# EAGLE design JEMA (EAGLE 9.6.2)

## Sheet 1 of 3
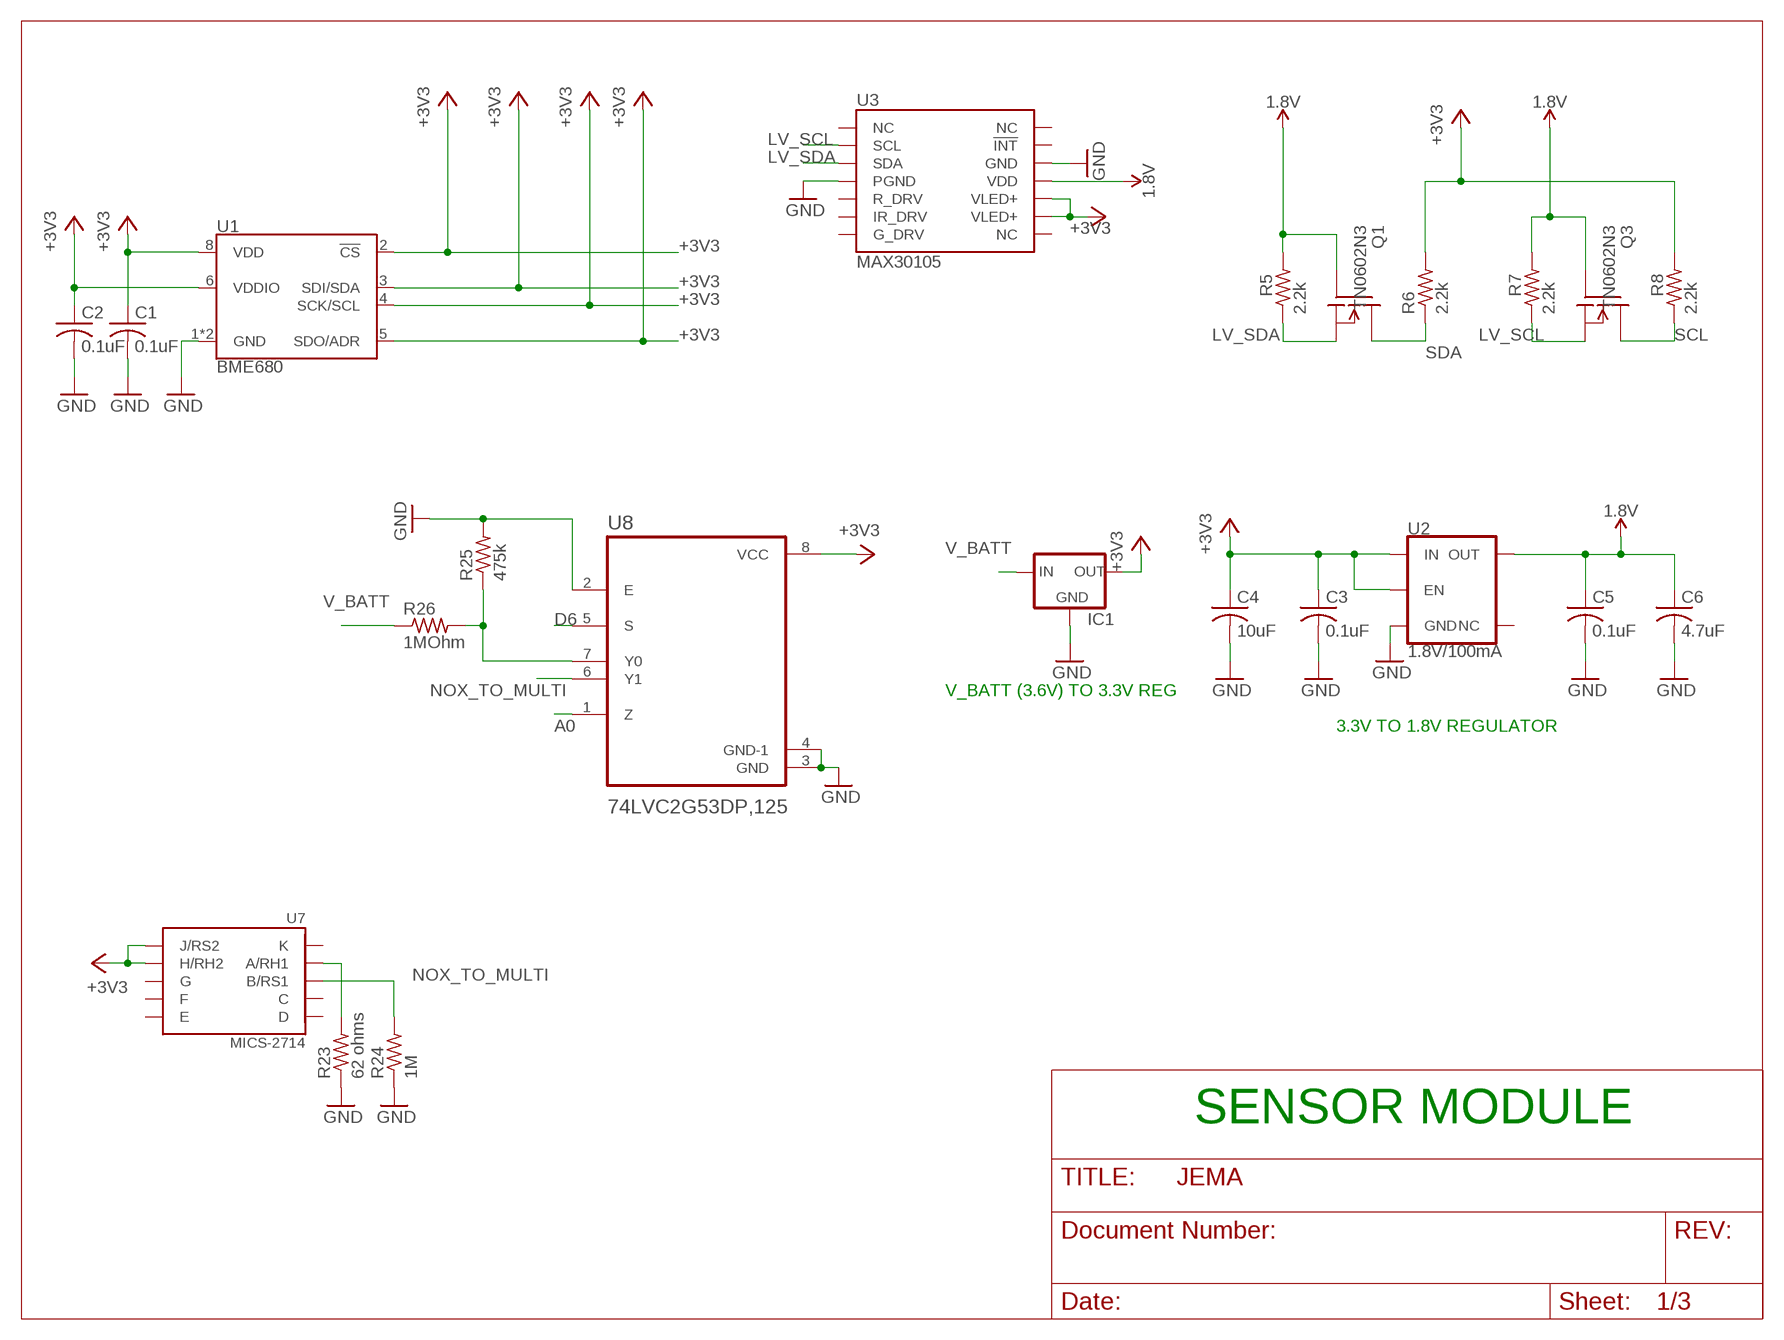
[diagram p0: schematic, sheet 1]

### Parts
C1  0.1uF  C-USC0805  [C0805]
C2  0.1uF  C-USC0805  [C0805]
C3  0.1uF  C-USC0805  [C0805]
C4  10uF  C-USC0805  [C0805]
C5  0.1uF  C-USC0805  [C0805]
C6  4.7uF  C-USC0805  [C0805]
IC1  MCP1700TRI  [TO92]
Q1  TN0602N3  [TO-92]
Q3  TN0602N3  [TO-92]
R5  2.2k  R-US_R0805  [R0805]
R6  2.2k  R-US_R0805  [R0805]
R7  2.2k  R-US_R0805  [R0805]
R8  2.2k  R-US_R0805  [R0805]
R23  62 ohms  R-US_M0805  [M0805]
R24  1M  R-US_M0805  [M0805]
R25  475k  R-US_M0805  [M0805]
R26  1MOhm  R-US_M0805  [M0805]
U1  BME680  BME680-LGA  [LGA3.0X3.0]
U2  1.8V/100mA  V_REG_SP6214-1.8V  [SC70]
U3  MAX30105  MAX3010X-30105  [OLGA-14]
U7  MICS-2714  [MICS-SMD10]
U8  74LVC2G53DP,125  [SOP65P490X110-8N]

### Nets
1.8V: C5.1 C6.1 Q1.2(G) Q3.2(G) R5.2 R7.2 U2.5(OUT) U3.11(VDD)
+3V3: C1.1 C2.1 C3.1 C4.1 IC1.3(OUT) R6.2 R8.2 U1.2(!CS) U1.3(SDI/SDA) U1.4(SCK/SCL) U1.5(SDO/ADR) U1.6(VDDIO) U1.8(VDD) U2.1(IN) U2.3(EN) U3.9(VLED+) U3.10(VLED+) U7.H(H/RH2) U7.J(J/RS2) U8.8(VCC) ; also sheet 2,3
A0: U8.1(Z) ; also sheet 2
D6: U8.5(S) ; also sheet 2
GND: C1.2 C2.2 C3.2 C4.2 C5.2 C6.2 IC1.1(GND) R23.1 R24.1 R25.2 U1.1(GND) U1.7(GND) U2.2(GND) U3.4(PGND) U3.12(GND) U8.2(E) U8.3(GND) U8.4(GND-1) ; also sheet 2,3
LV_SCL: Q3.1(S) R7.1 U3.2(SCL)
LV_SDA: Q1.1(S) R5.1 U3.3(SDA)
N$21: R25.1 R26.2 U8.7(Y0)
N$23: R23.2 U7.A(A/RH1)
NOX_TO_MULTI: R24.2 U7.B(B/RS1) U8.6(Y1)
SCL: Q3.3(D) R8.1 ; also sheet 2
SDA: Q1.3(D) R6.1 ; also sheet 2
V_BATT: IC1.2(IN) R26.1 ; also sheet 2,3
Unconnected: U2.4(NC) U3.1(NC) U3.5(R_DRV) U3.6(IR_DRV) U3.7(G_DRV) U3.8(NC) U3.13(!INT) U3.14(NC) U7.C U7.D U7.E U7.F U7.G U7.K

### Notes on the sheet
- V_BATT (3.6V) TO 3.3V REG
- 3.3V TO 1.8V REGULATOR
- SENSOR MODULE

## Sheet 2 of 3
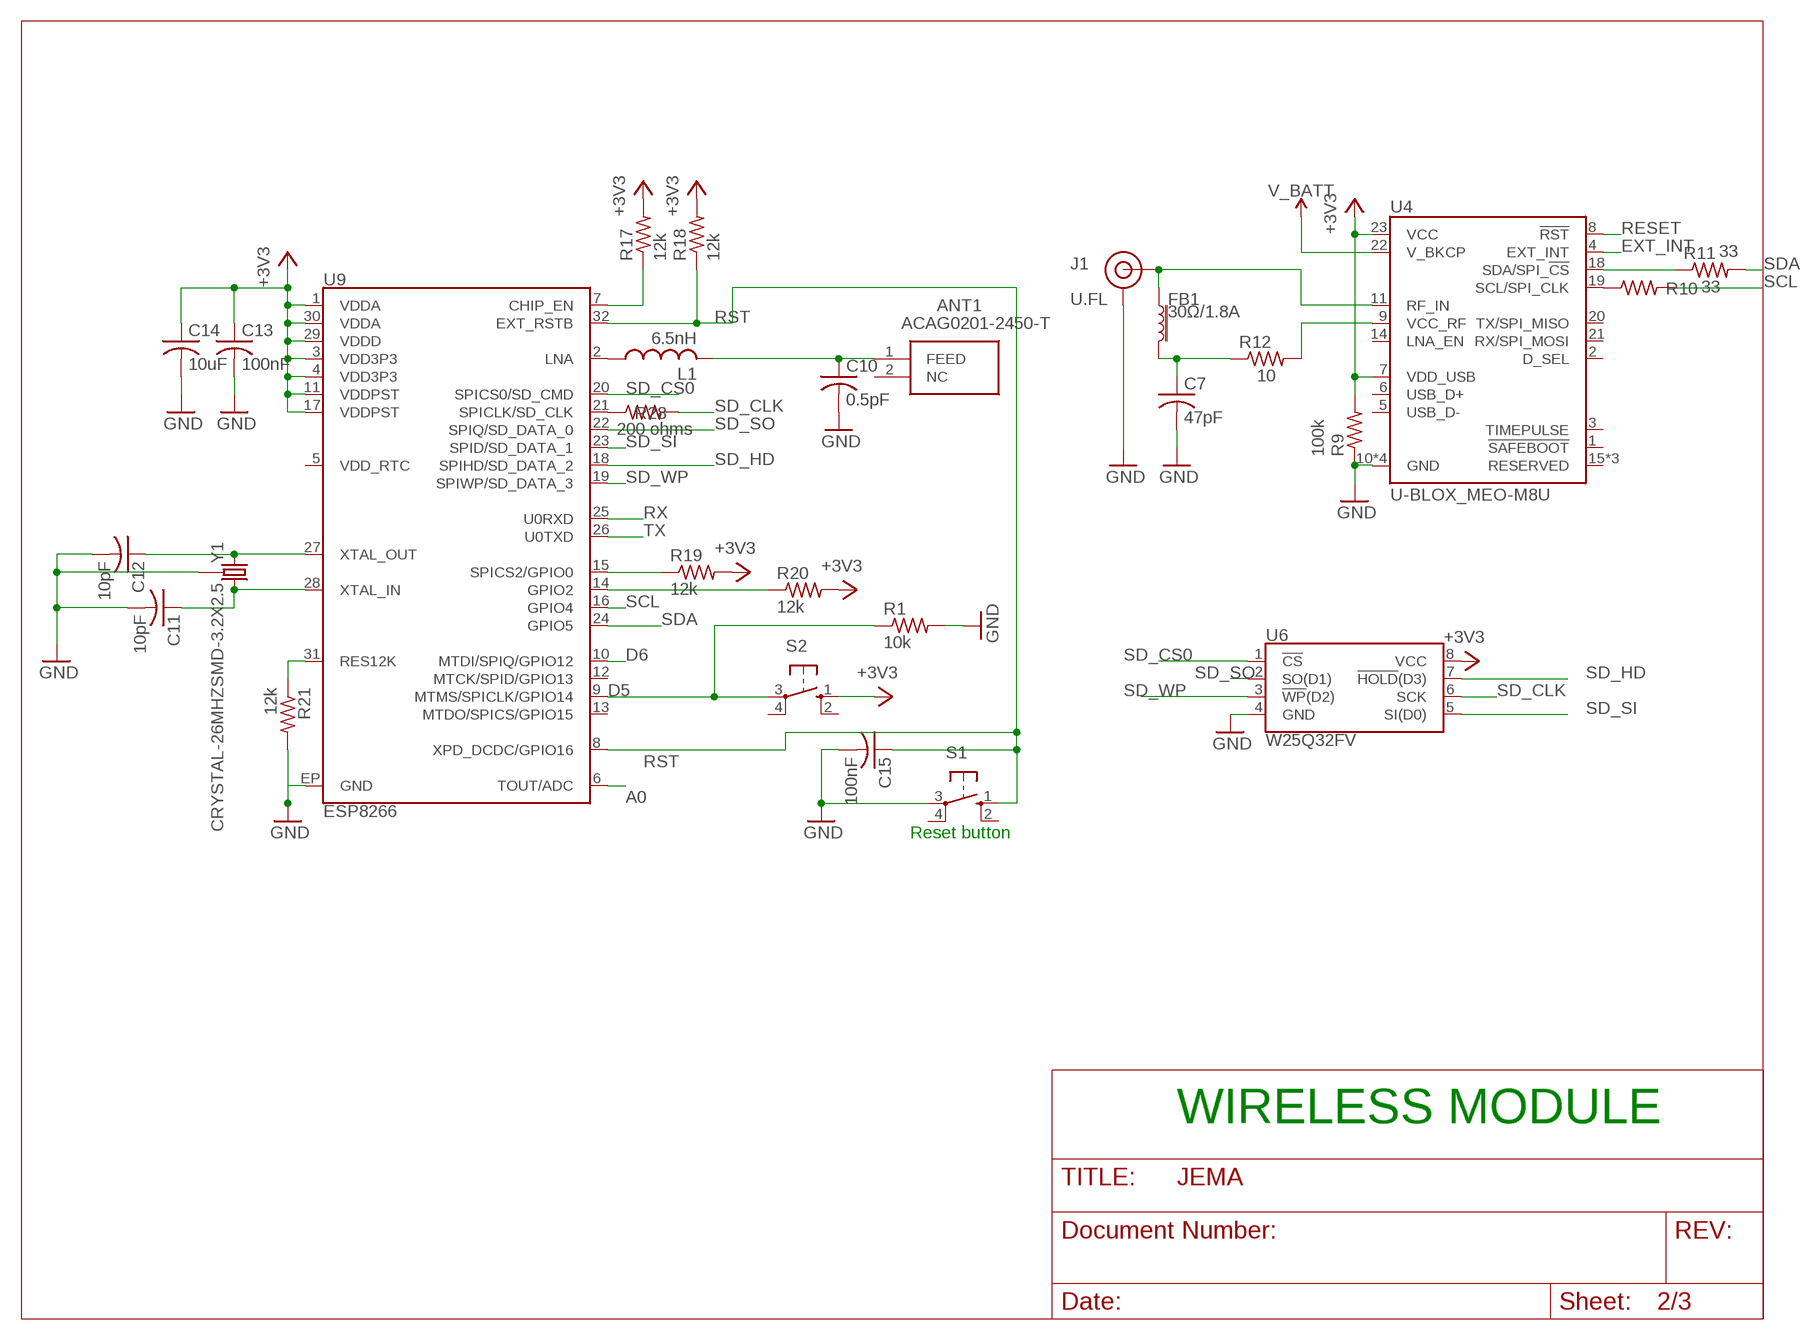
[diagram p1: schematic, sheet 2]

### Parts
ANT1  ACAG0201-2450-T  [ANTC2012X70N]
C7  47pF  C-USC0805  [C0805]
C10  0.5pF  C-USC0805  [C0805]
C11  10pF  C-USC0805  [C0805]
C12  10pF  C-USC0805  [C0805]
C13  100nF  C-USC0805  [C0805]
C14  10uF  C-USC0805  [C0805]
C15  100nF  C-USC0805  [C0805]
FB1  30Ω/1.8A  FERRITE_BEAD-0603  [0603]
J1  U.FL  U.FL2PIN  [U.FL]
L1  6.5nH  L-USL3225M  [L3225M]
R1  10k  R-US_R0805  [R0805]
R9  100k  R-US_R0805  [R0805]
R10  33  R-US_R0805  [R0805]
R11  33  R-US_R0805  [R0805]
R12  10  R-US_R0805  [R0805]
R17  12k  R-US_M0805  [M0805]
R18  12k  R-US_M0805  [M0805]
R19  12k  R-US_M0805  [M0805]
R20  12k  R-US_M0805  [M0805]
R21  12k  R-US_M0805  [M0805]
R28  200 ohms  R-US_R0805  [R0805]
S1  10-XX  [B3F-10XX]
S2  10-XX  [B3F-10XX]
U4  U-BLOX_MEO-M8U  [NEO-M9N/M8T/M8U]
U6  W25Q32FV  W25Q32FVSS  [SOIC-8]
U9  ESP8266  [QFN32-5X5MM]
Y1  CRYSTAL-26MHZSMD-3.2X2.5  [CRYSTAL-SMD-3.2X2.5MM]

### Nets
+3V3: C13.1 C14.1 R9.2 R17.2 R18.2 R19.2 R20.2 S2.1(S) U4.7(VDD_USB) U4.23(VCC) U6.8(VCC) U9.1(VDDA) U9.3(VDD3P3) U9.4(VDD3P3) U9.11(VDDPST) U9.17(VDDPST) U9.29(VDDD) U9.30(VDDA) ; also sheet 1,3
A0: U9.6(TOUT/ADC) ; also sheet 1
D5: R1.1 S2.3(P) U9.9(MTMS/SPICLK/GPIO14)
D6: U9.10(MTDI/SPIQ/GPIO12) ; also sheet 1
EXT_INT: U4.4(EXT_INT)
GND: C7.2 C10.2 C11.2 C12.2 C13.2 C14.2 C15.2 J1.1(GND) J1.2(GND) R1.2 R9.1 R21.2 S1.3(P) U4.10(GND) U4.12(GND) U4.13(GND) U4.24(GND) U6.4(GND) U9.EP(GND) Y1.2(GND) Y1.4(GND) ; also sheet 1,3
N$1: R10.1 U4.19(SCL/SPI_CLK)
N$2: R11.1 U4.18(SDA/SPI_!CS!)
N$5: C7.1 FB1.2 R12.1
N$7: R12.2 U4.9(VCC_RF)
N$9: R17.1 U9.7(CHIP_EN)
N$10: L1.1 U9.2(LNA)
N$11: ANT1.1(FEED) C10.1 L1.2
N$12: R19.1 U9.15(SPICS2/GPIO0)
N$13: R20.1 U9.14(GPIO2)
N$14: R21.1 U9.31(RES12K)
N$15: C12.1 U9.27(XTAL_OUT) Y1.1
N$16: C11.1 U9.28(XTAL_IN) Y1.3
N$17: FB1.1 J1.FEED(SIGNAL) U4.11(RF_IN)
N$25: R28.1 U9.21(SPICLK/SD_CLK)
RESET: U4.8(!RST)
RST: C15.1 R18.1 S1.1(S) U9.8(XPD_DCDC/GPIO16) U9.32(EXT_RSTB)
RX: U9.25(U0RXD)
SCL: R10.2 U9.16(GPIO4) ; also sheet 1
SD_CLK: R28.2 U6.6(SCK)
SD_CS0: U6.1(!CS!) U9.20(SPICS0/SD_CMD)
SD_HD: U6.7(!HOLD!(D3)) U9.18(SPIHD/SD_DATA_2)
SD_SI: U6.5(SI(D0)) U9.23(SPID/SD_DATA_1)
SD_SO: U6.2(SO(D1)) U9.22(SPIQ/SD_DATA_0)
SD_WP: U6.3(!WP!(D2)) U9.19(SPIWP/SD_DATA_3)
SDA: R11.2 U9.24(GPIO5) ; also sheet 1
TX: U9.26(U0TXD)
V_BATT: U4.22(V_BKCP) ; also sheet 1,3
Unconnected: ANT1.2(NC) S1.2(S1) S1.4(P1) S2.2(S1) S2.4(P1) U4.1(!SAFEBOOT!) U4.2(D_SEL) U4.3(TIMEPULSE) U4.5(USB_D-) U4.6(USB_D+) U4.14(LNA_EN) U4.15(RESERVED) U4.16(RESERVED) U4.17(RESERVED) U4.20(TX/SPI_MISO) U4.21(RX/SPI_MOSI) U9.5(VDD_RTC) U9.12(MTCK/SPID/GPIO13) U9.13(MTDO/SPICS/GPIO15)

### Notes on the sheet
- Reset button
- WIRELESS MODULE

## Sheet 3 of 3
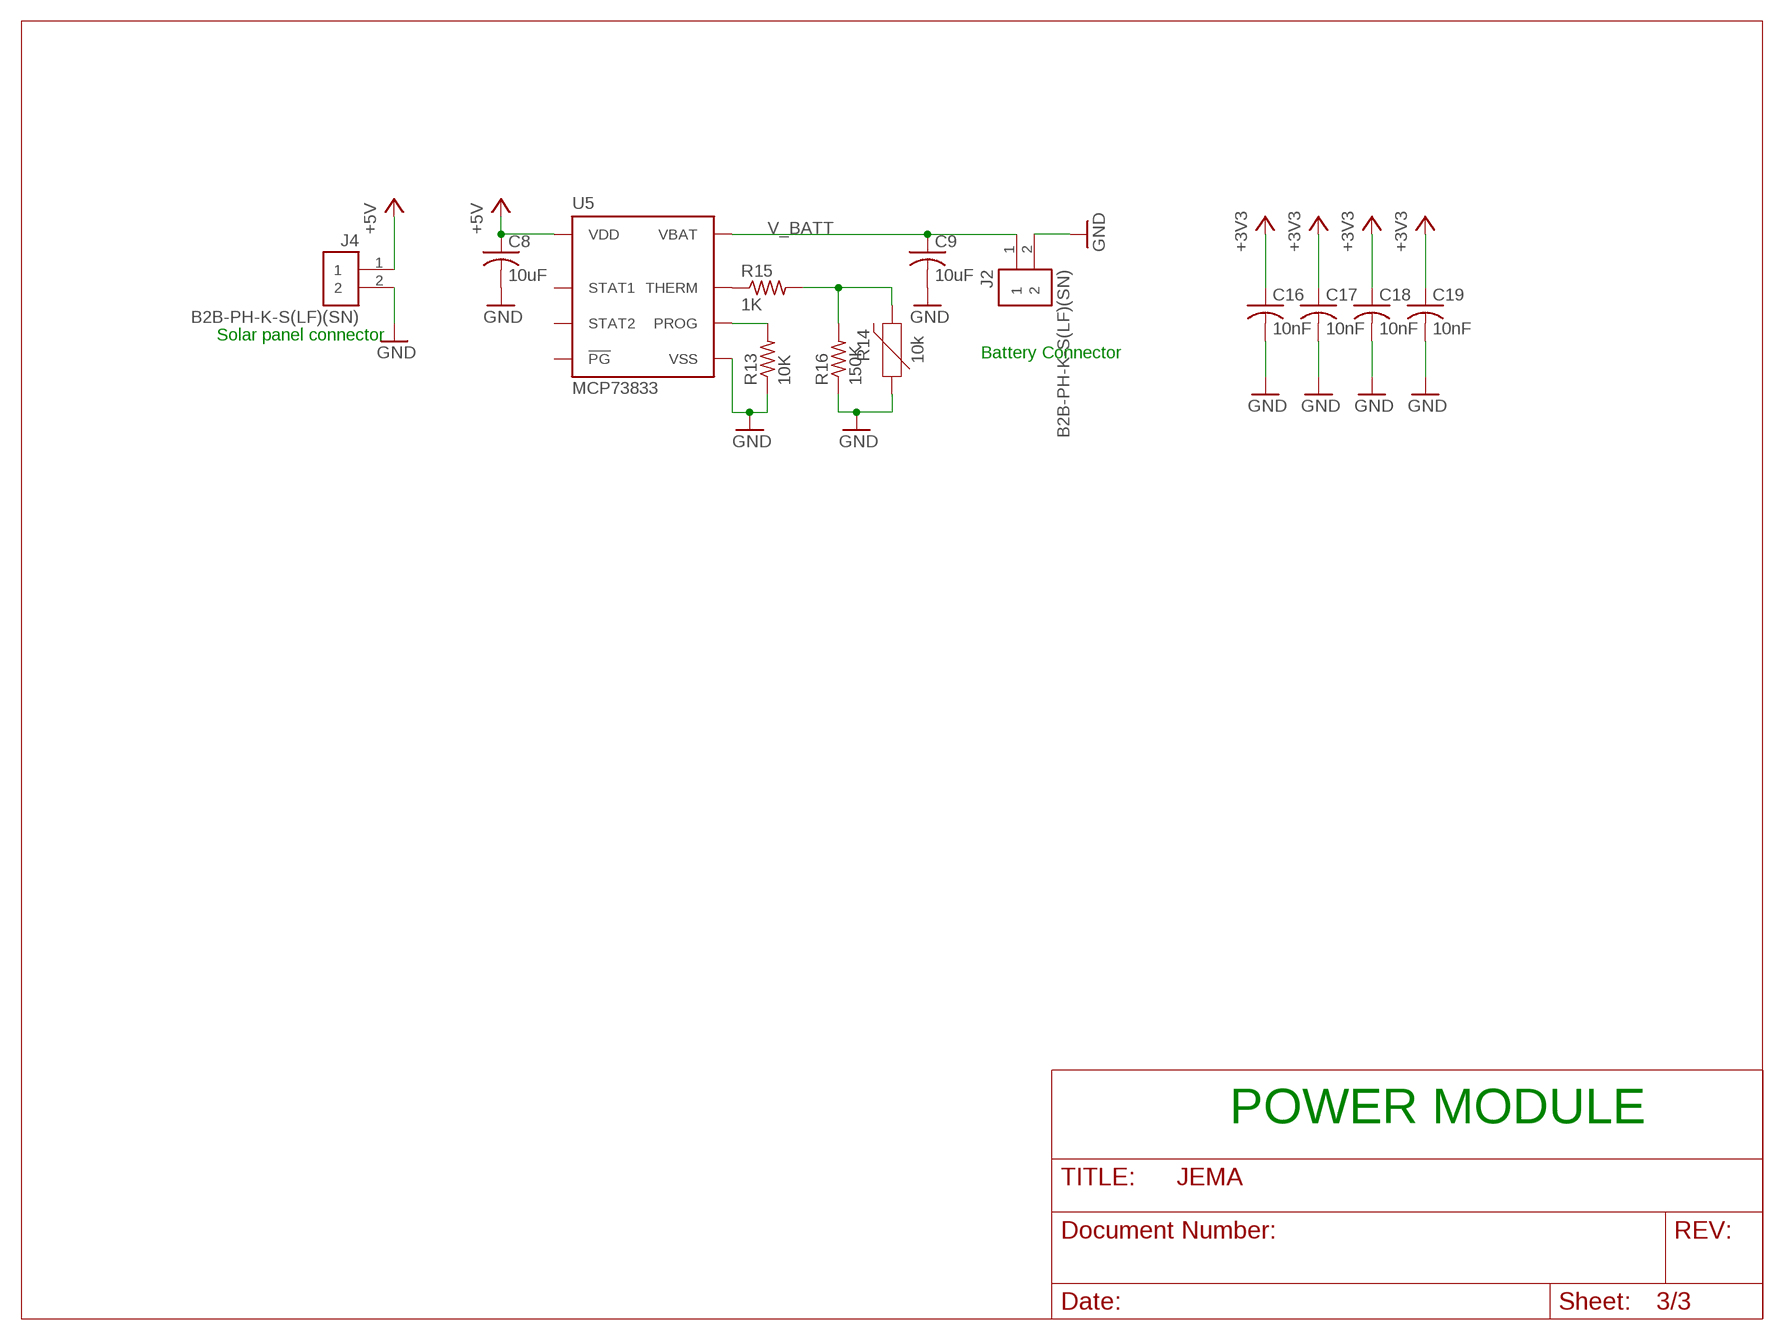
[diagram p2: schematic, sheet 3]

### Parts
C8  10uF  C-USC0805  [C0805]
C9  10uF  C-USC0805  [C0805]
C16  10nF  C-USC0805  [C0805]
C17  10nF  C-USC0805  [C0805]
C18  10nF  C-USC0805  [C0805]
C19  10nF  C-USC0805  [C0805]
J2  B2B-PH-K-S(LF)(SN)  [JST_B2B-PH-K-S(LF)(SN)]
J4  B2B-PH-K-S(LF)(SN)  [JST_B2B-PH-K-S(LF)(SN)]
R13  10K  R-US_R0805  [R0805]
R14  10k  NTC-THERMISTOR-0603  [0603]
R15  1K  R-US_R0805  [R0805]
R16  150K  R-US_R0805  [R0805]
U5  MCP73833  [DFN-10]

### Nets
+3V3: C16.1 C17.1 C18.1 C19.1 ; also sheet 1,2
+5V: C8.1 J4.1 U5.P$1(VDD) U5.P$2(VDD)
GND: C8.2 C9.2 C16.2 C17.2 C18.2 C19.2 J2.2 J4.2 R13.1 R14.1 R16.1 U5.P$5(VSS) U5.P$11(VSS) ; also sheet 1,2
N$3: R13.2 U5.P$6(PROG)
N$4: R15.1 U5.P$8(THERM)
N$8: R14.2 R15.2 R16.2
V_BATT: C9.1 J2.1 U5.P$9(VBAT) U5.P$10(VBAT) ; also sheet 1,2
Unconnected: U5.P$3(STAT1) U5.P$4(STAT2) U5.P$7(!PG)

### Notes on the sheet
- Solar panel connector
- Battery Connector
- POWER MODULE

## Library data of the parts
ANT1 = ACAG0201-2450-T:ACAG0201-2450-T: ABRACON - ACAG0201-2450-T - CERAMIC CHIP ANTENNA, 2.45GHZ, 50 OHM Source: Datasheet; DESCRIPTION: ABRACON - ACAG0201-2450-T - CERAMIC CHIP ANTENNA, 2.45GHZ, 50 OHM; HEIGHT: 0.7mm; MANUFACTURER_NAME: ABRACON; MANUFACTURER_PART_NUMBER: ACAG0201-2450-T; MOUSER_PART_NUMBER: 815-G0201-2450-T; MOUSER_PRICE-STOCK: https://www.mouser.co.uk/ProductDetail/ABRACON/ACAG0201-2450-T?qs=fAHHVMwC%252Bbhy8OyCmb16%252Bg%3D%3D
C1-C19 = rcl:C-US: CAPACITOR, American symbol; SPICEPREFIX: C
FB1 = SparkFun-Coils:FERRITE_BEAD: Ferrite Bead (blocks, cores, rings, chokes, etc.) Inductor with layers of ferrite used to suppress high frequencies. Often used to isolate high frequency noise. SparkFun Products: IOIO-OTG - V2.2 SparkFun SAMD21 Mini Breakout SparkFun 6 Degrees of Freedom Breakout - LSM6DS3 SparkFun SAMD21 Dev Breakout; PROD_ID: NDUC-13805
IC1 = adafruit:MCP1700: VOLTAGE REGULATOR
J1 = SparkFun-Connectors:U.FL2PIN: SMD Antenna Connector - U.FL 2mm height, 3.0mm x 3.0mm receptacle size. SparkFun Products: SparkFun WiFi Shield - ESP8266 <https://www.sparkfun.com/products/13287> SparkFun ESP8266 Thing <https://www.sparkfun.com/products/13231> SparkFun MiniGen - Pro Mini Signal Generator Shield <https://www.sparkfun.com/products/11420>; PROD_ID: CONN-09193; SF_ID: WRL-09144
J2 J4 = B2B-PH-K-S_LF__SN_:B2B-PH-K-S(LF)(SN): PH Series 2 Position 2 mm Pitch Through Hole Top Entry Shrouded Header Check prices; AVAILABILITY: Good; DESCRIPTION: Connector Header 2 position 0.079 (2.00mm); MF: JST Sales; MP: B2B-PH-K-S(LF)(SN); PACKAGE: None; PRICE: None; PURCHASE-URL: https://pricing.snapeda.com/search/part/B2B-PH-K-S(LF)(SN)/?ref=eda
L1 = rcl:L-US: INDUCTOR, American symbol; SPICEPREFIX: L
Q1 Q3 = transistor-fet:TN0602N3: N-Channel Enhancement MOSFET 20V; 4A; 0,75Ohm
R1 R5-R13 R15-R21 R23-R26 R28 = rcl:R-US_: RESISTOR, American symbol; SPICEPREFIX: R
R14 = SparkFun-Resistors:NTC-THERMISTOR: NTC Thermistor An NTC thermistor's resistance decreases as temperature rises. Applications: Resistance Thermometer - temperature monitoring Inrush current limiter Heat source; PROD_ID: RES-13608
S1 S2 = switch-omron:10-XX: OMRON SWITCH; MPN: B3F-1000; OC_FARNELL: 176432; OC_NEWARK: 36M3542
U1 = SparkFun-Sensors:BME680: Bosch BME680 – Combined Humidity and Pressure Sensor The BME680 is as combined digital humidity, pressure and temperature sensor based on proven sensing principles. The sensor module is housed in an extremely compact metal-lid LGA package with a footprint of only 3.0×3.0mm with a height of 0.93mm. Its small dimensions and its low power consumption allow the implementation in battery driven devices such as handsets, GPS modules or watches.; PROD_ID: IC-14656
U2 = SparkFun-IC-Power:V_REG_SP6214: Voltage Regulator - SP6214 SP6214 Series SC-70-5 Micropower SC-70 100 mA CMOS LDO Regulator Datasheet <https://www.exar.com/content/document.ashx?id=654> SparkFun Products: MP3 Trigger <https://www.sparkfun.com/products/13720> SparkFun Particle Sensor Breakout <https://www.sparkfun.com/products/14045>; PROD_ID: VREG-08428
U3 = SparkFun-Sensors:MAX3010X: MAX30105 High Sensitivity Optical Sensor Can be used for Pulse Detection, Pulse Ox, and possible visual particle detection. I2C communication. Datasheet <https://datasheets.maximintegrated.com/en/ds/MAX30105.pdf> SparkFun Products: SparkFun Particle Sensor Breakout - MAX30105 <https://www.sparkfun.com/products/14045>; PROD_ID: IC-13510
U4 = SparkFun-GPS:U-BLOX_MEO-M8U: u-blox NEO-M8U The NEO-M8U module introduces u-blox’s Untethered Dead Reckoning (UDR) technology, which provides continuous navigation without requiring speed information from the vehicle. This innovative technology brings the benefits of dead reckoning to installations previously restricted to using GNSS alone, and significantly reduces the cost of installation for after-market dead reckoning applications. The strength of UDR is particularly apparent under poor signal conditions, where it brings continuous positioning in urban environments, even to devices with antennas installed within the vehicle. Useful positioning performance is also available during complete signal loss, for example in parking garages and short tunnels. With UDR, positioning starts as soon as power is applied to the module, before the first GNSS fix is available. The NEO-M8U may be installed in any position within the vehicle without configuration. In addition to its freedom from any electrical connection to the vehicle, the on-board accelerometer and gyroscope sensors result in a fully self-contained solution, perfect for rapid product development with reliable and consistent performance.; PROD_ID: IC-14850
U5 = SparkFun-IC-Power:MCP73833; PROD_ID: IC-14369
U6 = SparkFun-IC-Memory:W25Q32FV: W25Q32FV 32Mb (4MB) Serial Flash Memory The W25Q32FV support the standard Serial Peripheral Interface (SPI), Dual/Quad I/O SPI as well as 2-clocks instruction cycle Quad Peripheral Interface (QPI). 104MHz, SPI, 8-SOIC-EIAJ Datasheet SparkFun Products SparkFun Blynk Board - ESP8266 (WRL-13794); PROD_ID: IC-13229
U7 = MICS-2714:MICS-2714: Check prices; AVAILABILITY: Bad; DESCRIPTION: MiCS-2714 Nitrogen Dioxide (NO2) Sensor mikroBUS™ Click™ Platform Evaluation Expansion Board; MF: SGX Sensortech; MP: MICS-2714; PACKAGE: None; PRICE: None; PURCHASE-URL: https://pricing.snapeda.com/search/part/MICS-2714/?ref=eda
U8 = 74LVC2G53DP:74LVC2G53DP,125: None Check prices; AVAILABILITY: Good; DESCRIPTION: 1 Circuit IC Switch 2:1 10Ohm 8-TSSOP; MF: Nexperia USA; MP: 74LVC2G53DP,125; PACKAGE: TSSOP8-8 Nexperia USA Inc.; PRICE: None; PURCHASE-URL: https://pricing.snapeda.com/search/part/74LVC2G53DP,125/?ref=eda
U9 = SparkFun-RF:ESP8266: Espressif ESP8266 WiFi/Microcontroller SoC The ESP8266 WiFi Module is a self contained SOC with integrated TCP/IP protocol stack that can give any microcontroller access to your WiFi network. The ESP8266 is capable of either hosting an application or offloading all Wi-Fi networking functions from another application processor. SparkFun Products WiFi Module ESP8266 (WRL-13678) SparkFun ESP8266 Thing (WRL-13231) SparkFun WiFi Shield - ESP8266 (WRL-13287) SparkFun ESP8266 Thing - Dev Board (WRL-13711) SparkFun Blynk Board - ESP8266 (WRL-13794); PROD_ID: IC-12452
Y1 = SparkFun-Clocks:CRYSTAL-26MHZ: 26MHz Crystal w/ Ground Pin Digikey Example <http://www.digikey.com/product-detail/en/epson/TSX-3225%2026.0000MF09Z-AC3/SER3627CT-ND/1802878> Frequency: 26MHz Frequency Stability: ±9ppm Frequency Tolerance: ±10ppm Load Capacitance: 9pF SparkFun Products: SparkFun ESP32 Thing <https://www.sparkfun.com/products/13907> SparkFun ESP8266 Thing Dev Board <https://www.sparkfun.com/products/13711>; PROD_ID: XTAL-12454

## Board
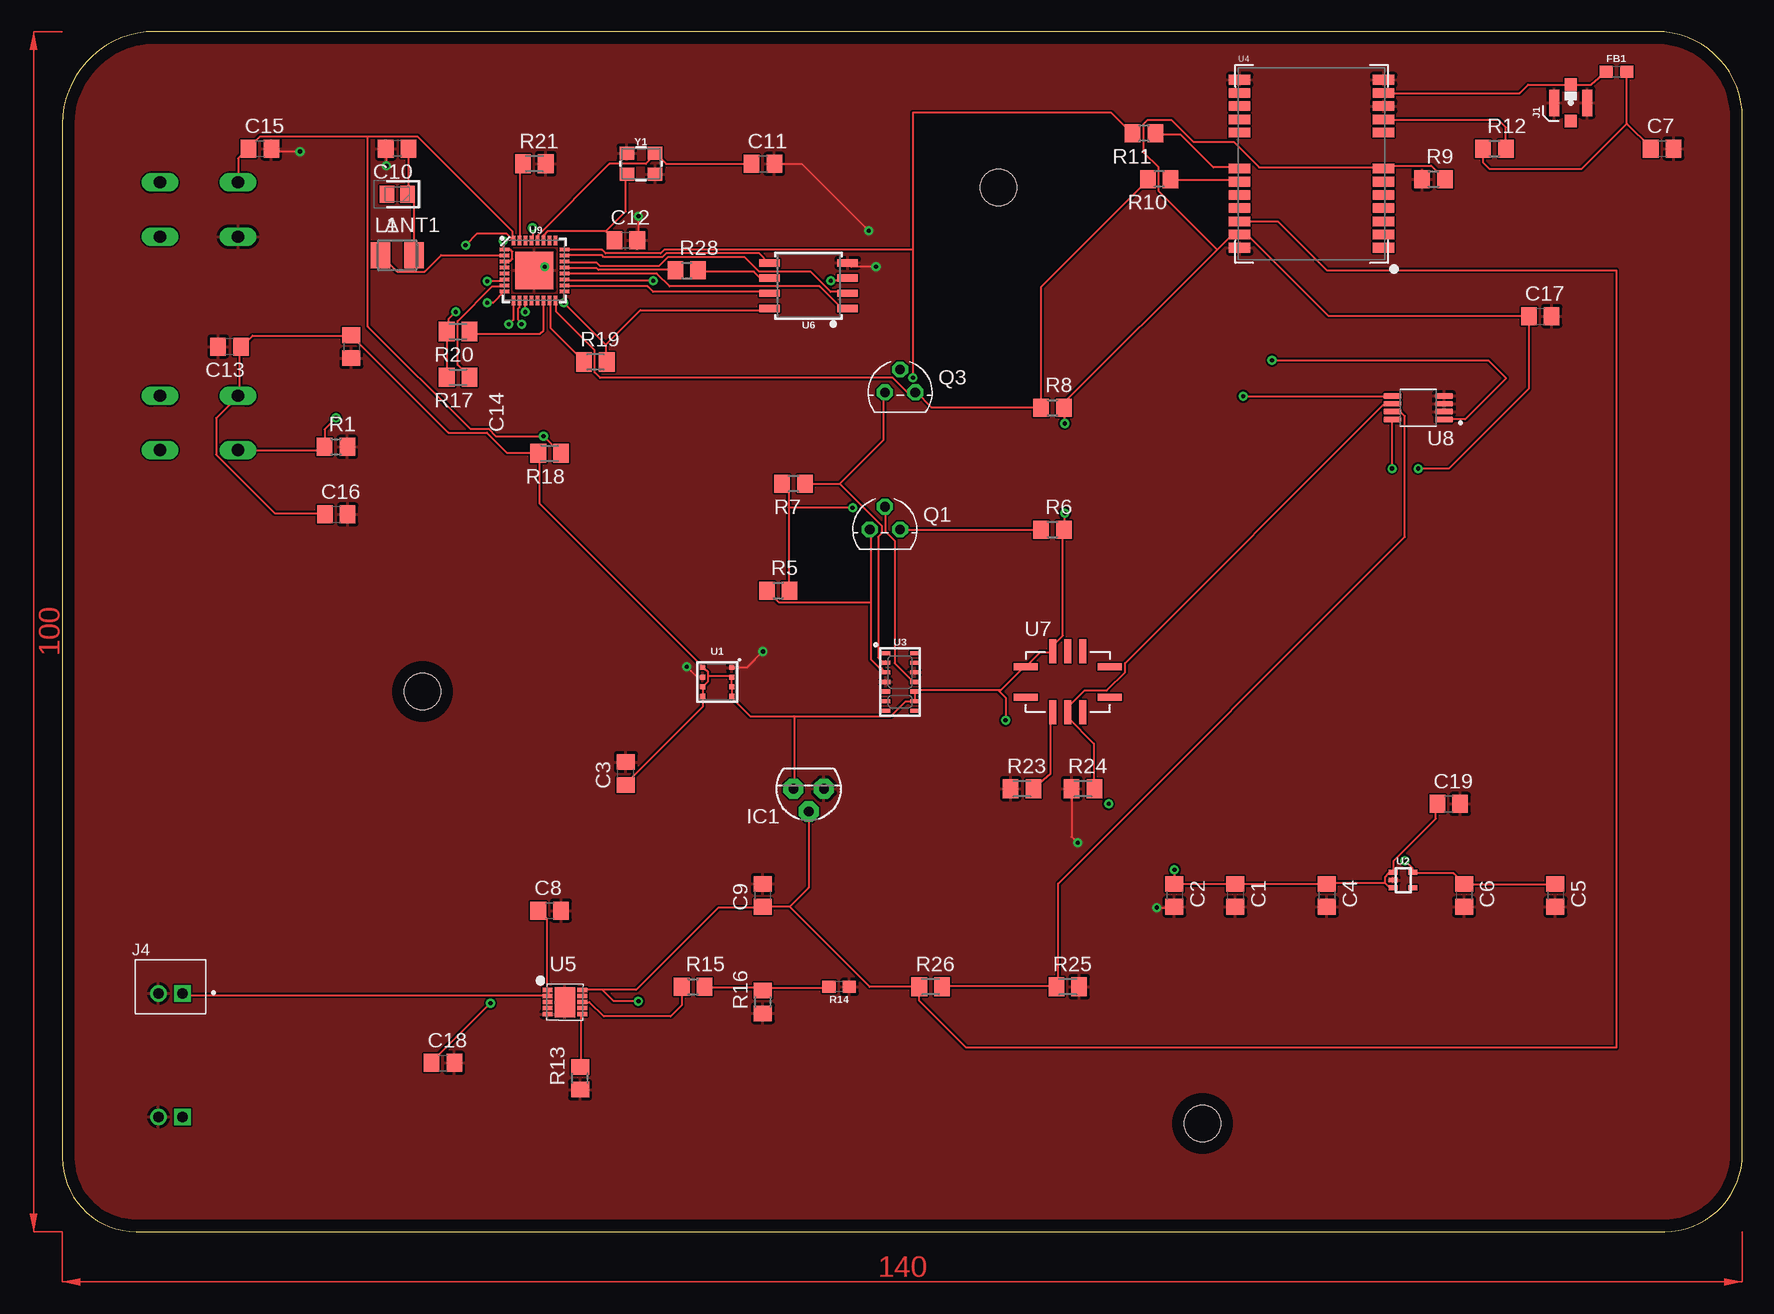
[diagram p3: board, top side]
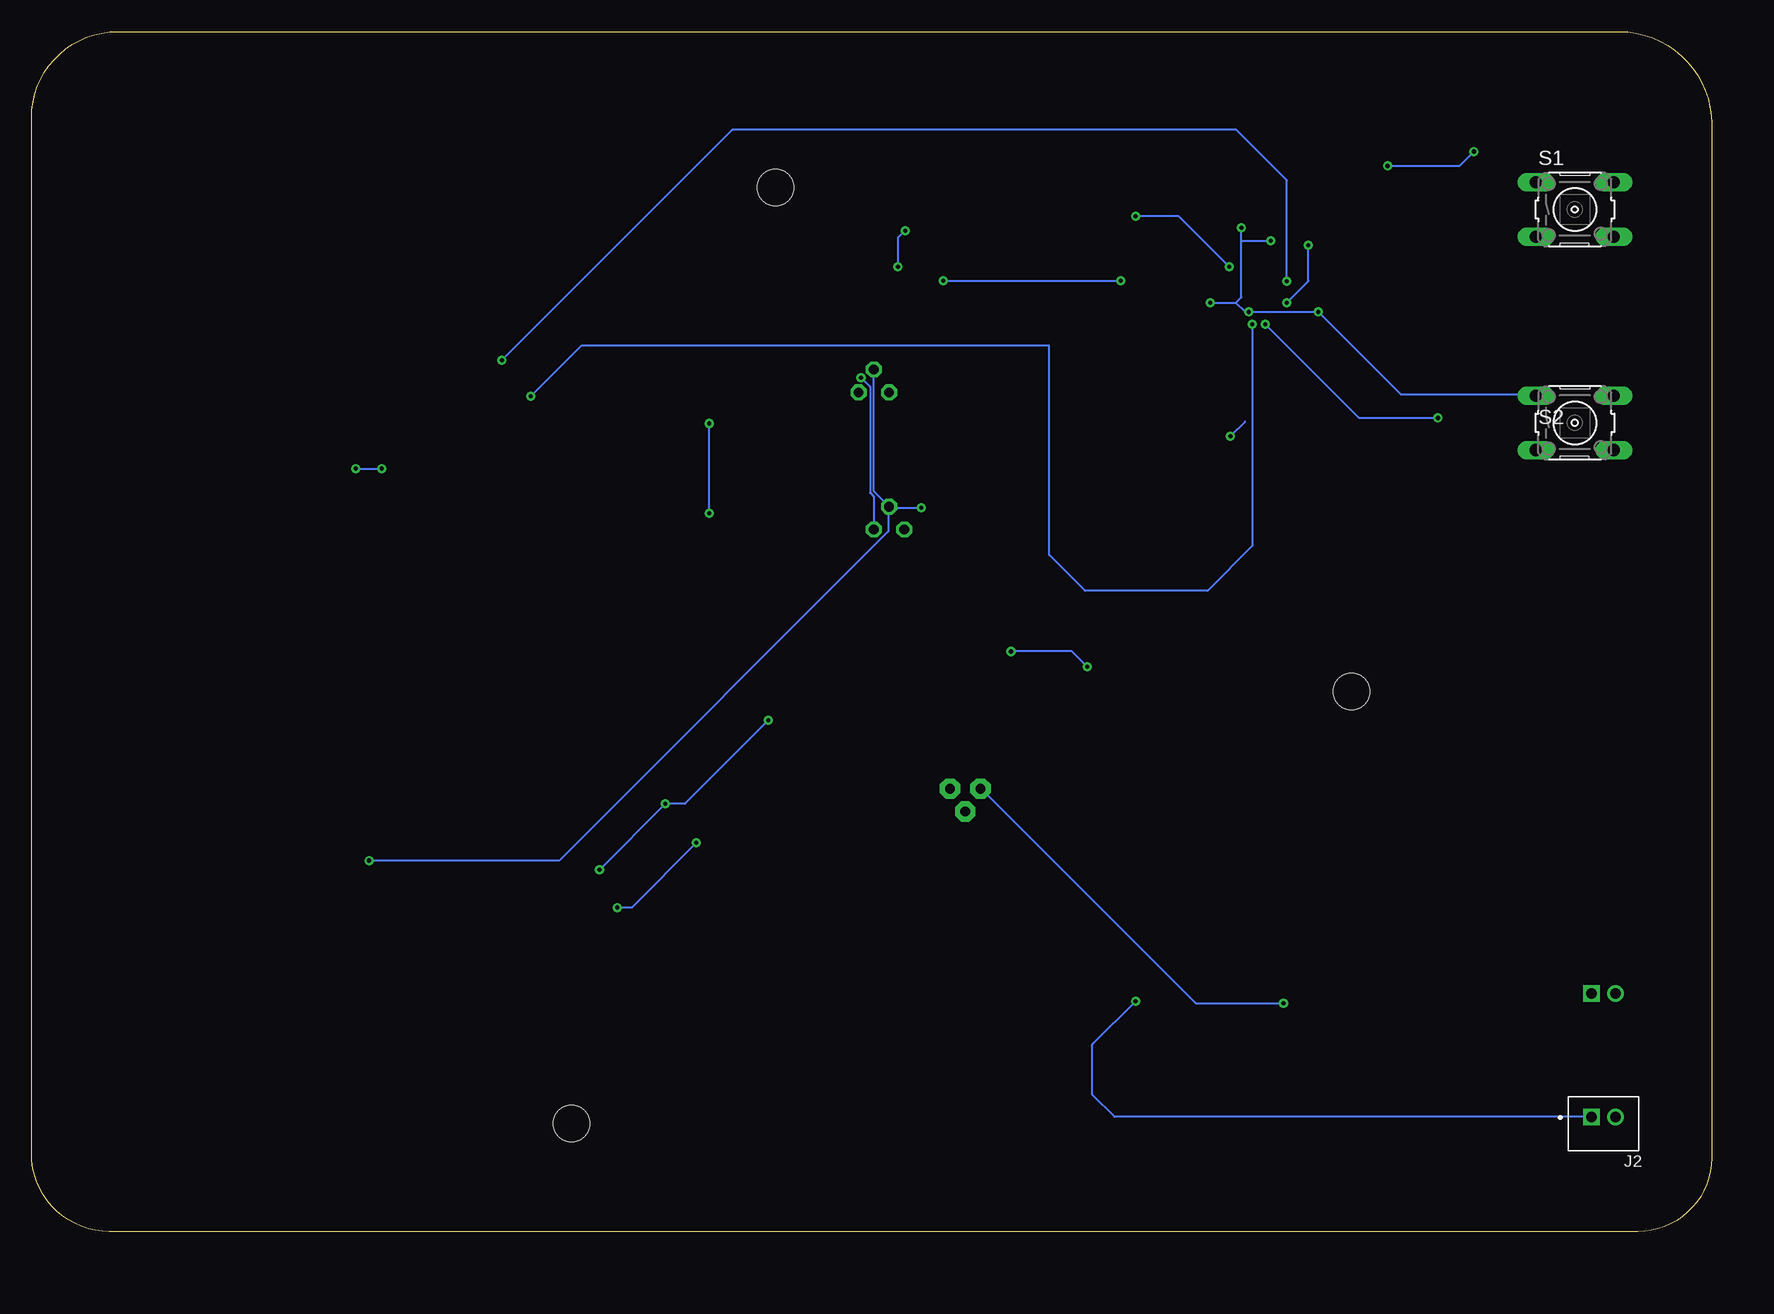
[diagram p4: board, bottom side, seen from below]

Size 140 x 100 mm. Coordinates in mm from the lower left corner, seen from the top.
Outline: 140,6.48 140,92.83 arc90 132.83,100 7.7,100 arc90 0,92.3 0,6.15 arc90 6.15,0 133.52,0 arc90 140,6.48
Copper layers (1*16): Top 0.035mm / dielectric 1.5mm / Bottom 0.035mm
Design rules "default": minimum track width 6mil, minimum drill 0.35mm, track to track 6mil, track to pad 6mil, pad to pad 6mil, via to via 6mil, smd to smd 6mil, copper to edge 40mil, drill to drill 6mil, minimum pad ring 10mil, minimum via ring 8mil, stop-mask expansion 4mil, vias tented up to drill 0mil, thermal gap 10mil
Holes 3 mm at 78,87 95,9 30,45

### Footprints (pad centres in the part's own frame; a part is rotated, then mirrored left to right if it is on the bottom)
ANTC2012X70N = smd 1.2 x 1.45: 1 -0.85,0; 2 0.85,0
C0805 = smd 1.3 x 1.5: 1 -0.95,0; 2 0.95,0
0603 = smd 1.1 x 1: 1 -0.85,0; 2 0.85,0
TO92 = drill 0.813 pad 1.676 octagon: 1 -1.27,0; 2 0,1.905; 3 1.27,0
U.FL = smd 2.2 x 0.85: 1 0,1.375; 2 0,-1.375 | smd 1.05 x 1: FEED 1.525,0; NC -1.525,0
JST_B2B-PH-K-S(LF)(SN) = drill 0.86 square: 1 1,-0.55 | drill 0.86: 2 -1,-0.55
L3225M = smd 1.6 x 2.2: 1 -1.4,0; 2 1.4,0
TO-92 = drill 0.813 octagon: 1 -1.27,0; 2 0,1.905; 3 1.27,0
R0805 = smd 1.3 x 1.5: 1 -0.95,0; 2 0.95,0
M0805 = smd 1.3 x 1.6: 1 -0.95,0; 2 0.95,0
B3F-10XX = drill 1.016 long: 1 -3.251,2.261; 2 3.251,2.261; 3 -3.251,-2.261; 4 3.251,-2.261
LGA3.0X3.0 = smd 0.4 x 0.4: 1 1.2,1.2; 2 1.2,0.4; 3 1.2,-0.4; 4 1.2,-1.2; 5 -1.2,-1.2; 6 -1.2,-0.4; 7 -1.2,0.4; 8 -1.2,1.2
SC70 = smd 0.4 x 0.75: 1 -0.65,-0.825; 2 0,-0.825; 3 0.65,-0.825; 4 0.65,0.825; 5 -0.65,0.825
OLGA-14 = smd 0.75 x 0.35: 1 -1.2,2.4; 2 -1.2,1.6; 3 -1.2,0.8; 4 -1.2,0; 5 -1.2,-0.8; 6 -1.2,-1.6; 7 -1.2,-2.4; 8 1.2,-2.4; 9 1.2,-1.6; 10 1.2,-0.8; 11 1.2,0; 12 1.2,0.8; 13 1.2,1.6; 14 1.2,2.4
NEO-M9N/M8T/M8U = smd 1.8 x 0.8: 1 6,-7; 2 6,-5.9; 3 6,-4.8; 4 6,-3.7; 5 6,-2.6; 6 6,-1.5; 7 6,-0.4; 8 6,2.6; 9 6,3.7; 10 6,4.8; 11 6,5.9; 12 6,7; 13 -6,7; 14 -6,5.9; 15 -6,4.8; 16 -6,3.7; 17 -6,2.6; 18 -6,-0.4; 19 -6,-1.5; 20 -6,-2.6; 21 -6,-3.7; 22 -6,-4.8; 23 -6,-5.9; 24 -6,-7
DFN-10 = smd 0.8 x 0.35: P$1 -1.45,1; P$2 -1.45,0.5; P$3 -1.45,0; P$4 -1.45,-0.5; P$5 -1.45,-1; P$6 1.45,-1; P$7 1.45,-0.5; P$8 1.45,0; P$9 1.45,0.5; P$10 1.45,1 | smd 1.7 x 2.5: P$11 0,0
SOIC-8 = smd 0.61 x 1.702: 1 -1.905,-3.251; 2 -0.635,-3.251; 3 0.635,-3.251; 4 1.905,-3.251; 5 1.905,3.251; 6 0.635,3.251; 7 -0.635,3.251; 8 -1.905,3.251
MICS-SMD10 = smd 0.6 x 2: A -1.25,-2.54; B 0,-2.54; C 1.25,-2.54; F 1.25,2.54; G 0,2.54; H -1.25,2.54 | smd 2 x 0.6: D 3.5,-1.27; E 3.5,1.27; J -3.5,1.27; K -3.5,-1.27
SOP65P490X110-8N = smd 1.47 x 0.48: 1 -2.15,0.975; 2 -2.15,0.325; 3 -2.15,-0.325; 4 -2.15,-0.975; 5 2.15,-0.975; 6 2.15,-0.325; 7 2.15,0.325; 8 2.15,0.975
QFN32-5X5MM = smd 0.8 x 0.285: 1 -2.5,1.75; 2 -2.5,1.25; 3 -2.5,0.75; 4 -2.5,0.25; 5 -2.5,-0.25; 6 -2.5,-0.75; 7 -2.5,-1.25; 8 -2.5,-1.75; 17 2.5,-1.75; 18 2.5,-1.25; 19 2.5,-0.75; 20 2.5,-0.25; 21 2.5,0.25; 22 2.5,0.75; 23 2.5,1.25; 24 2.5,1.75 | smd 0.285 x 0.8: 9 -1.75,-2.5; 10 -1.25,-2.5; 11 -0.75,-2.5; 12 -0.25,-2.5; 13 0.25,-2.5; 14 0.75,-2.5; 15 1.25,-2.5; 16 1.75,-2.5; 25 1.75,2.5; 26 1.25,2.5; 27 0.75,2.5; 28 0.25,2.5; 29 -0.25,2.5; 30 -0.75,2.5; 31 -1.25,2.5; 32 -1.75,2.5 | smd 3.15 x 3.15: EP 0,0
CRYSTAL-SMD-3.2X2.5MM = smd 1.2 x 1.1: 1 -1.175,-0.875; 2 1.175,-0.875; 3 1.175,0.875; 4 -1.175,0.875

### Placement (x,y rotation side)
ANT1  27.9,86.44 180 top
C1  97.75,28.02 270 top
C2  92.67,28.02 270 top
C3  46.95,38.18 90 top
C4  105.37,28.02 270 top
C5  124.42,28.02 270 top
C6  116.8,28.02 270 top
C7  133.31,90.25 0 top
C8  40.6,26.75 0 top
C9  58.38,28.02 90 top
C10  27.9,90.25 180 top
C11  58.38,88.98 0 top
C12  46.95,82.63 0 top
C13  13.93,73.74 180 top
C14  24.09,73.74 270 top
C15  16.47,90.25 0 top
C16  22.82,59.77 0 top
C17  123.15,76.28 0 top
C18  31.71,14.05 0 top
C19  115.53,35.64 0 top
FB1  129.5,96.67 0 top
IC1  62.19,36.91 180 top
J1  125.69,94.06 90 top
J2  9,9 180 bottom
J4  9,20.4 0 top
L1  27.9,81.36 0 top
Q1  68.54,58.5 0 top
Q3  69.81,69.93 0 top
R1  22.8,65.4 0 top
R5  59.65,53.42 0 top
R6  82.51,58.5 0 top
R7  60.92,62.31 180 top
R8  82.51,68.66 0 top
R9  114.26,87.71 0 top
R10  91.4,87.71 180 top
R11  90.13,91.52 180 top
R12  119.34,90.25 0 top
R13  43.14,12.78 90 top
R14  64.73,20.4 180 top
R15  52.56,20.4 0 top
R16  58.38,19.13 90 top
R17  32.98,71.2 180 top
R18  40.6,64.85 180 top
R19  44.41,72.47 0 top
R20  32.98,75.01 180 top
R21  39.33,88.98 0 top
R23  79.97,36.91 0 top
R24  85.05,36.91 0 top
R25  83.78,20.4 0 top
R26  72.35,20.4 0 top
R28  52.03,80.09 0 top
S1  11.39,85.17 0 bottom
S2  11.39,67.39 0 bottom
U1  54.57,45.8 0 top
U2  111.72,29.29 270 top
U3  69.81,45.8 0 top
U4  104.1,88.98 0 top
U5  41.87,19.13 0 top
U6  62.19,78.82 90 top
U7  83.78,45.8 0 top
U8  112.99,68.66 180 top
U9  39.33,80.09 0 top
Y1  48.22,88.98 0 top

### Tracks (layer width: path | path; a pad name or v marks a point on that pad's centre or on a via)
1.8V  (via drill 0.35)
  Top 0.152: C5.1 124.32,28.93 116.85,28.93 C6.1 116.7,29.09 115.94,29.85 112.63,29.85 U2.5 112.48,30 112.48,30.31 v111.87,30.92 | 60.51,60.33 60.51,61.85 60.06,62.31 R7.2 | 60.51,60.33 60.51,53.47 R5.2 | U3.11 70.88,45.85 69.35,47.38 69.35,57.59 68.59,58.35 68.59,60.33 Q1.2 | v65.85,60.33 60.51,60.33
  Bottom 0.152: Q3.2 69.81,61.7 68.59,60.48 Q1.2 | v65.85,60.33 68.44,60.33 Q1.2 | v111.87,30.92 96.02,30.92 68.59,58.35 68.59,60.33 Q1.2
+3V3  (via drill 0.35)
  Top 0.152: R9.2 115.12,87.76 114.06,88.83 110.4,88.83 110.25,88.67 U4.7 110.09,88.67 99.73,88.67 97.6,90.81 94.25,90.81 92.42,92.64 90.44,92.64 90.13,92.33 90.13,89.89 91.35,88.67 91.35,86.69 96.23,81.82 | 96.23,81.82 97.44,83.04 98.06,83.04 U4.23 98.16,83.04 98.77,83.04 105.47,76.33 122.08,76.33 C17.1 122.2,70.25 115.53,63.58 v112.99,63.58 | 96.23,81.82 83.46,69.05 R8.2 83.53,68.56 v83.53,67.34 | 110.2,29.09 110.5,28.78 110.81,28.78 U2.3 | 110.2,29.09 110.2,29.54 110.5,29.85 110.81,29.85 U2.1 110.96,30 110.96,30.92 114.46,34.42 114.46,35.64 C19.1 | 110.2,29.09 105.47,29.09 C4.1 105.32,28.93 97.85,28.93 C1.1 97.7,28.93 92.67,28.93 C2.1 v92.67,30.15 | 78,45.09 78.19,45.09 80.17,47.07 U7.J 81.5,48.29 82.61,48.29 U7.H 82.61,48.44 82.61,48.9 83.37,49.66 83.37,58.5 R6.2 83.53,58.5 v83.53,59.87 | 78,45.09 71.03,45.09 U3.10 71.03,44.94 71.03,44.33 U3.9 70.88,44.17 70.27,44.17 69.05,42.95 60.97,42.95 | v110.81,63.58 110.81,67.64 U8.8 | 24.09,74.65 15.86,74.65 14.95,73.74 C13.1 14.79,73.74 14.79,69.93 14.64,69.78 S2.1 14.64,69.62 12.81,67.8 12.81,64.75 17.69,59.87 21.8,59.87 C16.1 | 24.09,74.65 32.17,66.58 35.37,66.58 37.04,64.9 39.63,64.9 R18.2 39.79,64.75 39.79,60.63 53.35,47.07 U1.8 53.5,46.92 53.81,46.61 53.81,46.31 | 24.09,74.65 C14.1 | R17.2 32.02,71.3 32.02,74.96 R20.2 32.17,75.11 32.17,76.03 v32.78,76.64 | U9.4 36.89,80.45 36.89,80.75 U9.3 36.89,80.9 37.35,80.9 37.5,81.06 37.5,81.67 37.35,81.82 36.89,81.82 U9.1 36.74,81.97 v36.74,82.58 | U9.30 38.72,82.58 39.02,82.58 U9.29 39.18,82.73 v39.18,83.65 | v38.57,76.64 38.57,77.55 U9.11 | U9.17 41.77,78.31 v41.77,77.4 45.27,73.89
  Top 0.152: 45.27,73.89 45.27,72.52 R19.2 | 45.27,73.89 48.17,76.79 58.84,76.79 U6.8 | 53.81,46.31 53.81,45.85 53.5,45.55 U1.6 53.35,45.39 53.35,44.63 U1.5 53.35,44.48 53.35,43.72 46.95,37.32 C3.1 | 53.81,46.31 55.64,46.31 U1.2 55.79,46.16 55.79,45.55 U1.3 55.79,45.39 55.79,44.63 U1.4 55.79,44.48 57.31,42.95 60.97,42.95 | v35.67,19.03 30.8,14.15 C18.1 | 60.97,42.95 60.97,37.01 IC1.3 | 78,45.09 78.6,44.49 v78.6,42.6
  Bottom 0.152: v92.67,30.15 v87.18,35.64 85.56,35.64 v78.6,42.6 | 39.63,77.4 38.87,76.64 v38.57,76.64 v32.78,76.64 25.92,69.78 14.64,69.78 S2.1 | v41.77,77.4 39.63,77.4 | 39.18,82.58 39.18,77.86 39.63,77.4 | 39.18,82.58 v39.18,83.65 | 39.18,82.58 v36.74,82.58 | v83.53,59.87 v83.53,67.34 | v35.67,19.03 42.99,19.03 60.82,36.86 IC1.3 | v112.99,63.58 v110.81,63.58
+5V
  Top 0.152: C8.1 39.74,26.7 40.35,26.09 40.35,20.15 U5.P$1 40.5,19.99 40.5,19.69 U5.P$2 40.35,19.69 10.22,19.69 10.06,19.85 J4.1
A0  (via drill 0.35)
  Top 0.152: U9.6 36.7,79.21 36.34,79.21 36.32,79.2 v35.4,79.2 | v100.8,72.6 118.8,72.6 120.3,71.1 116.89,67.69 U8.1
  Bottom 0.152: v35.4,79.2 35.4,87.6 39.6,91.8 81.6,91.8 v100.8,72.6
D5  (via drill 0.35)
  Top 0.152: U9.9 37.58,75.98 v37.2,75.6 | v22.8,67.8 21.85,66.85 R1.1 21.58,65.13 S2.3
  Bottom 0.152: v37.2,75.6 29.4,67.8 v22.8,67.8
D6  (via drill 0.35)
  Top 0.152: U9.10 38.08,77.01 37.96,76.89 37.96,76.04 38.4,75.6 v38.27,75.6 | v98.4,69.6 110.81,69.6 U8.5
  Bottom 0.152: v38.27,75.6 38.27,57.13 42,53.4 52.2,53.4 55.2,56.4 55.2,73.8 94.2,73.8 v98.4,69.6
GND  (via drill 0.35)
  Top 0.152: U1.7 52.9,46.2 v52.03,47.07 | v58.38,48.34 57.04,47 U1.1 | C10.2 27,90.2 v27,88.8 | v19.8,90 17.67,90 C15.2 | U9.EP 39.64,80.4 v40.2,80.4 | v48,84.6 48,82.73 C12.2 | R24.1 84.1,32.9 v84.6,32.4 | v91.2,27 92.6,27 C2.2 | C11.2 61.62,88.98 v67.2,83.4 | v67.8,80.4 65.77,80.4 U6.4
  Bottom 0.152: v52.03,47.07 53.3,48.34 v58.38,48.34 | v27,88.8 21,88.8 v19.8,90 | v40.2,80.4 44.4,84.6 v48,84.6 | v84.6,32.4 90,27 v91.2,27 | v67.2,83.4 67.8,82.8 v67.8,80.4
  pour Top: -8.93,105.49 -8.93,-6.27 -7.66,-7.54 146.01,-7.54 147.28,-6.27 147.28,105.49
LV_SCL
  Top 0.152: 64.78,62.31 68.29,58.8 68.29,58.2 67.98,57.89 67.98,47.83 68.29,47.53 68.59,47.53 U3.2 | R7.1 64.78,62.31 | 64.78,62.31 68.44,65.97 68.44,69.93 Q3.1
LV_SDA
  Top 0.152: 67.37,52.4 67.37,58.5 Q1.1 | 67.37,52.4 67.37,47.68 68.13,46.92 68.29,46.92 68.59,46.61 U3.3 | 67.37,52.4 59.75,52.4 58.84,53.32 R5.1
N$1
  Top 0.152: R10.1 92.42,87.61 98.06,87.61 U4.19
N$2
  Top 0.152: R11.1 91.2,91.42 93.18,91.42 95.92,88.67 98.06,88.67 U4.18
N$3
  Top 0.152: U5.P$6 43.24,18.01 43.24,13.74 R13.2
N$4
  Top 0.152: U5.P$8 43.92,19.13 45.12,17.93 50.69,17.93 51.61,18.85 R15.1
N$5
  Top 0.152: 130.36,92.33 130.36,96.66 FB1.2 | 130.36,92.33 132.34,90.35 C7.1 | 130.36,92.33 126.56,88.53 118.94,88.53 118.39,89.09 R12.1
N$7
  Top 0.152: R12.2 120.29,92.01 119.67,92.64 110.25,92.64 U4.9
N$8
  Top 0.152: R14.2 63.82,20.3 58.63,20.3 58.48,20.15 R16.2 58.33,20.15 58.18,20.3 53.58,20.3 R15.2
N$9
  Top 0.152: U9.7 36.74,78.77 35.83,78.77 32.93,75.87 32.93,72.22 33.84,71.3 R17.1
N$10
  Top 0.152: U9.2 36.74,81.36 31.56,81.36 30.19,79.99 27.9,79.99 26.53,81.36 L1.1
N$11
  Top 0.152: C10.1 28.81,90.2 28.81,86.54 ANT1.1 28.81,86.39 29.27,85.93 29.27,81.36 L1.2
N$12
  Top 0.152: U9.15 40.7,77.55 40.7,75.26 43.45,72.52 R19.1
N$13
  Top 0.152: U9.14 40.09,77.55 40.09,75.11 39.79,74.81 34.15,74.81 34,74.96 R20.1
N$14
  Top 0.152: U9.31 38.11,82.73 38.11,88.83 38.26,88.98 R21.1
N$15
  Top 0.152: 45.27,83.34 40.4,83.34 40.09,83.04 40.09,82.73 U9.27 | 45.27,83.34 45.88,82.73 C12.1 | 45.27,83.34 46.95,85.02 46.95,88.07 Y1.1
N$16
  Top 0.152: U9.28 39.63,82.73 39.63,83.04 45.58,88.98 48.63,88.98 49.39,89.74 Y1.3 49.54,89.74 50.3,88.98 C11.1
N$17
  Top 0.152: FB1.1 127.42,95.58 J1.FEED 122.14,95.58 121.43,94.88 U4.11
N$21
  Top 0.152: U8.7 110.96,68.25 111.57,68.25 111.87,67.95 111.87,57.89 82.97,28.98 82.97,20.45 R25.1 82.81,20.45 73.37,20.45 R26.2
N$23
  Top 0.152: R23.2 82.31,38.12 82.31,43.11 82.46,43.26 U7.A
N$25
  Top 0.152: U9.21 41.92,80.29 44.51,80.29 44.66,80.14 51.06,80.14 R28.1
NOX_TO_MULTI
  Top 0.152: 83.83,43.26 83.83,43.72 85.2,45.09 87.03,45.09 88.56,46.61 88.56,47.38 110.04,68.86 110.81,68.86 U8.6 | 83.83,43.26 83.83,42.8 85.96,40.67 85.96,37.01 R24.2 | 83.83,43.26 U7.B
RST  (via drill 0.35)
  Top 0.152: R18.1 41.46,64.9 v40.09,66.27 36.13,66.27 35.52,66.88 34,66.88 25.46,75.42 25.46,91.27 | 37.54,82.66 37.5,82.73 37.5,83.34 29.58,91.27 25.46,91.27 | 37.54,82.66 U9.32 | S1.1 14.64,89.44 15.4,90.2 C15.1 15.56,90.35 16.47,91.27 25.46,91.27 | U9.8 35.89,77.4 v35.4,77.4 | 37.54,82.66 37.52,82.66 36.99,83.19 34.59,83.19 v33.6,82.2
  Bottom 0.152: v40.09,66.27 38.87,67.49 | v35.4,77.4 33.6,79.2 v33.6,82.2
SCL
  Top 0.152: U9.16 41.16,77.55 41.16,76.64 44.36,73.44 44.36,71.61 44.82,71.15 69.2,71.15 70.42,69.93 Q3.3 71.18,69.93 72.4,68.71 81.55,68.71 R8.1 81.56,78.73 90.44,87.61 R10.2
SD_CLK
  Top 0.152: R28.2 53.05,79.99 57.62,79.99 58.08,79.53 58.84,79.53 U6.6
SD_CS0
  Top 0.152: U9.20 41.92,79.84 49.54,79.84 50.61,78.77 63.1,78.77 64.93,76.94 65.39,76.94 U6.1
SD_HD
  Top 0.152: U9.18 41.92,78.77 48.78,78.77 49.24,78.31 58.84,78.31 U6.7
SD_SI
  Top 0.152: U9.23 41.92,81.36 44.97,81.36 45.12,81.21 50,81.21 50.3,81.51 58.08,81.51 58.84,80.75 U6.5
SD_SO
  Top 0.152: U9.22 41.92,80.75 44.51,80.75 44.82,80.45 49.69,80.45 50.45,81.21 56.86,81.21 58.08,79.99 62.34,79.99 64.02,78.31 65.39,78.31 U6.2
SD_WP  (via drill 0.35)
  Top 0.152: v49.24,79.23 41.92,79.23 U9.19 | v64.02,79.23 65.24,79.23 65.39,79.38 U6.3
  Bottom 0.152: v64.02,79.23 v49.24,79.23
SDA  (via drill 0.35)
  Top 0.152: Q1.3 R6.1 | R11.2 89.06,91.57 87.39,93.25 70.88,93.25 70.88,81.82 | 70.88,81.82 v70.88,71.15 | 70.88,81.82 50.15,81.82 49.85,81.51 45.27,81.51 44.97,81.82 41.92,81.82 U9.24
  Bottom 0.152: Q1.3 69.81,61.24 70.11,61.55 70.11,70.39 v70.88,71.15
V_BATT  (via drill 0.35)
  Top 0.152: U5.P$9 43.39,19.69 43.39,19.99 U5.P$10 43.39,20.15 45,20.15 | 45,20.15 47.81,20.15 54.67,27 58.33,27 C9.1 60.6,27.07 | 98.21,84.1 U4.22 101.28,84.18 105.37,80.09 129.5,80.09 129.5,15.32 75.32,15.32 71.4,19.24 R26.1 | 71.28,20.2 71.39,20.3 R26.1 | R26.1 67.27,20.4 60.6,27.07 | IC1.2 62.19,28.66 60.6,27.07 | v48,19.2 45.95,19.2 45,20.15
  Bottom 0.152: J2.1 49.75,9.55 51.6,11.4 51.6,15.6 v48,19.2
(copper drawn outside any net)
  shapes: Top area x2